# EAGLE design Grove - CO2 & Temperature & Humidity Sensor (SCD30) (EAGLE 9.1.2)

## Sheet 1 of 2
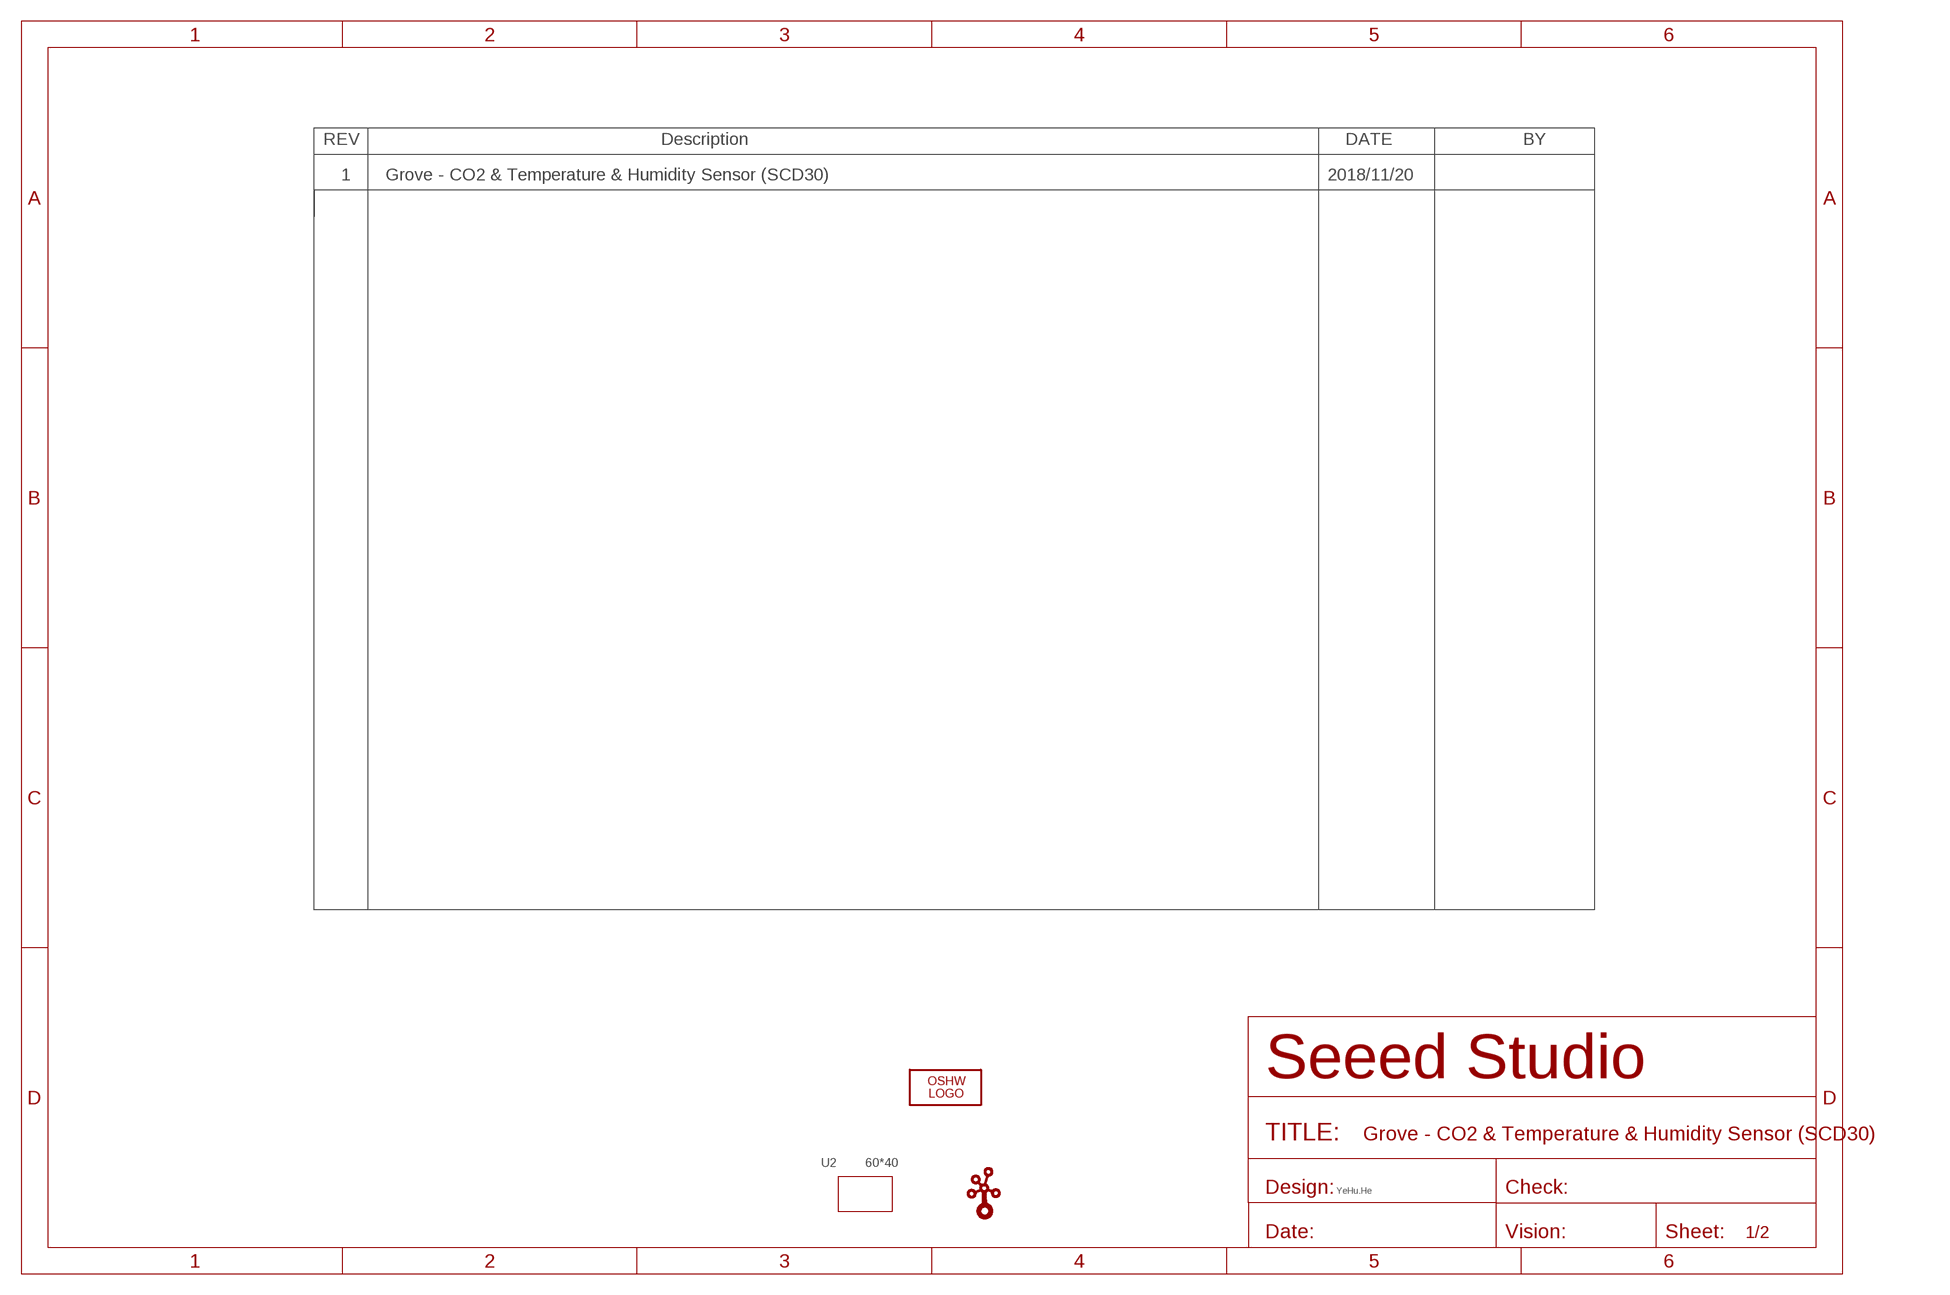
[diagram p0: schematic, sheet 1]

### Parts
LOGO1  LOGO-OSHW-FILLX0200-NT  [OSHW_FILLX200_NOTEXT]
U2  60*40  GROVE-60X40MM  [GROVE-60X40MM]
U$4  LOGO-GROVE  [GROVE-SILK-BIG]

### Notes on the sheet
- 1 | Grove - CO2 & Temperature & Humidity Sensor (SCD30) | 2018/11/20
- YeHu.He

## Sheet 2 of 2
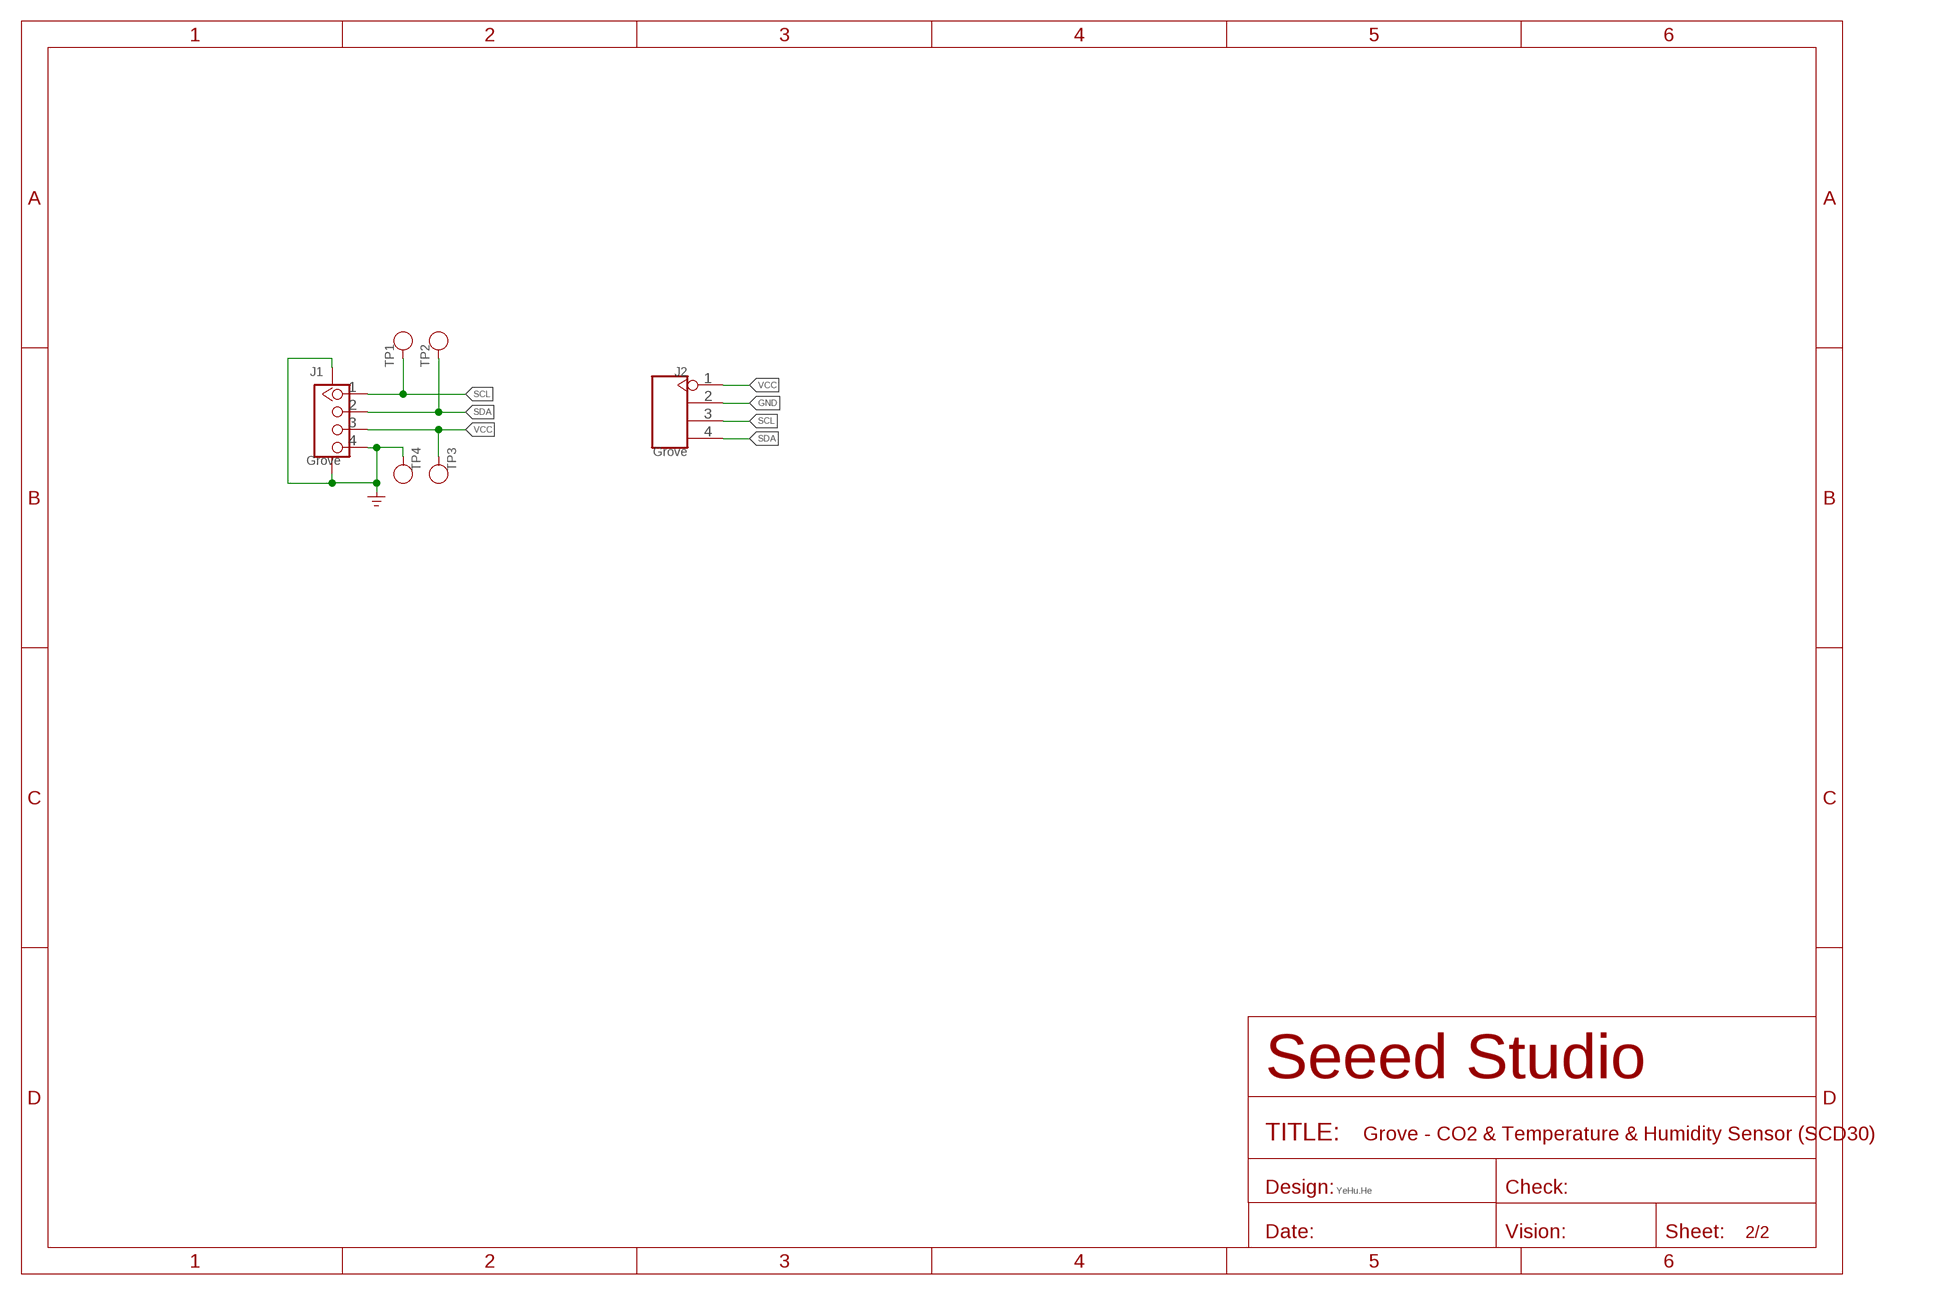
[diagram p1: schematic, sheet 2]

### Parts
J1  Grove  GROVE-CONNECTOR-SMD'90D'  [HW4-SMD-2.0-90D]
J2  Grove  HEADER-4P-65/35MIL  [H4-2.54]
TP1  Test  TEST-POINT'4545'  [TP-D45MIL]
TP2  Test  TEST-POINT'4545'  [TP-D45MIL]
TP3  Test  TEST-POINT'4545'  [TP-D45MIL]
TP4  Test  TEST-POINT'4545'  [TP-D45MIL]

### Nets
GND: J1.4 J1.SS1 J1.SS2 J2.2 TP4.T ; supply symbol labelled GND_POWER
SCL: J1.1 J2.3 TP1.T
SDA: J1.2 J2.4 TP2.T
VCC: J1.3 J2.1 TP3.T

### Notes on the sheet
- YeHu.He

## Library data of the parts
J1 = Connector-new:GROVE-CONNECTOR-SMD: 4P-SMD-2.0:320110030;4P-SMD-2.0-90D:320110032
J2 = Connector-new:HEADER-4P
LOGO1 = logo:LOGO-OSHW-FILL; PARTNO: DNP
TP1-TP4 = Discrete-new:TEST-POINT; PARTNO: DNP
U2 = moudle-new:GROVE
U$4 = logo:LOGO-GROVE; PARTNO: DNP

## Board
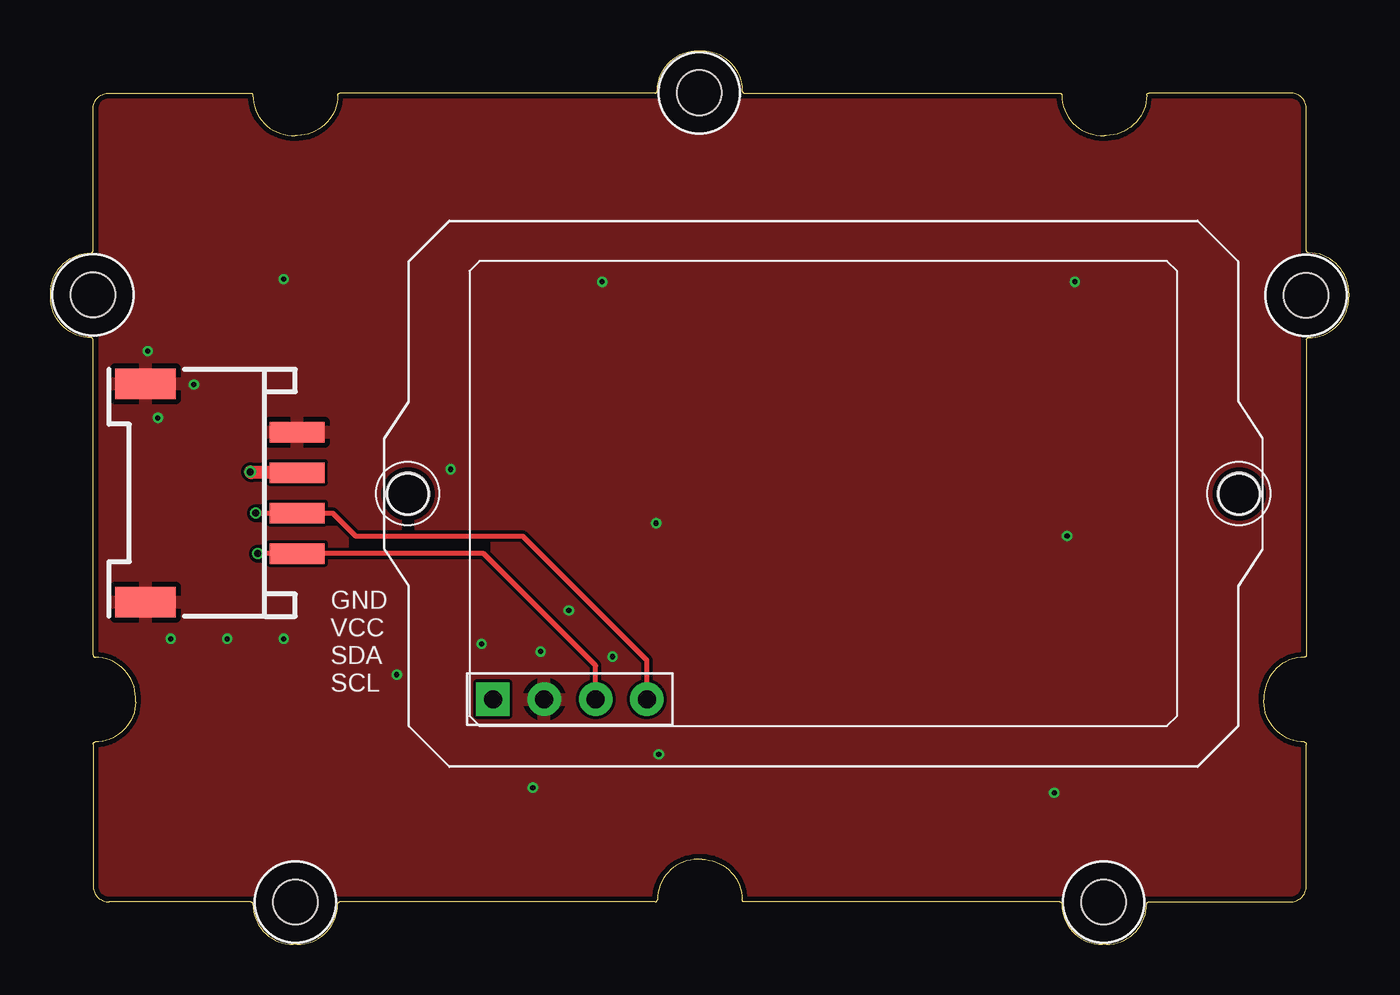
[diagram p2: board, top side]
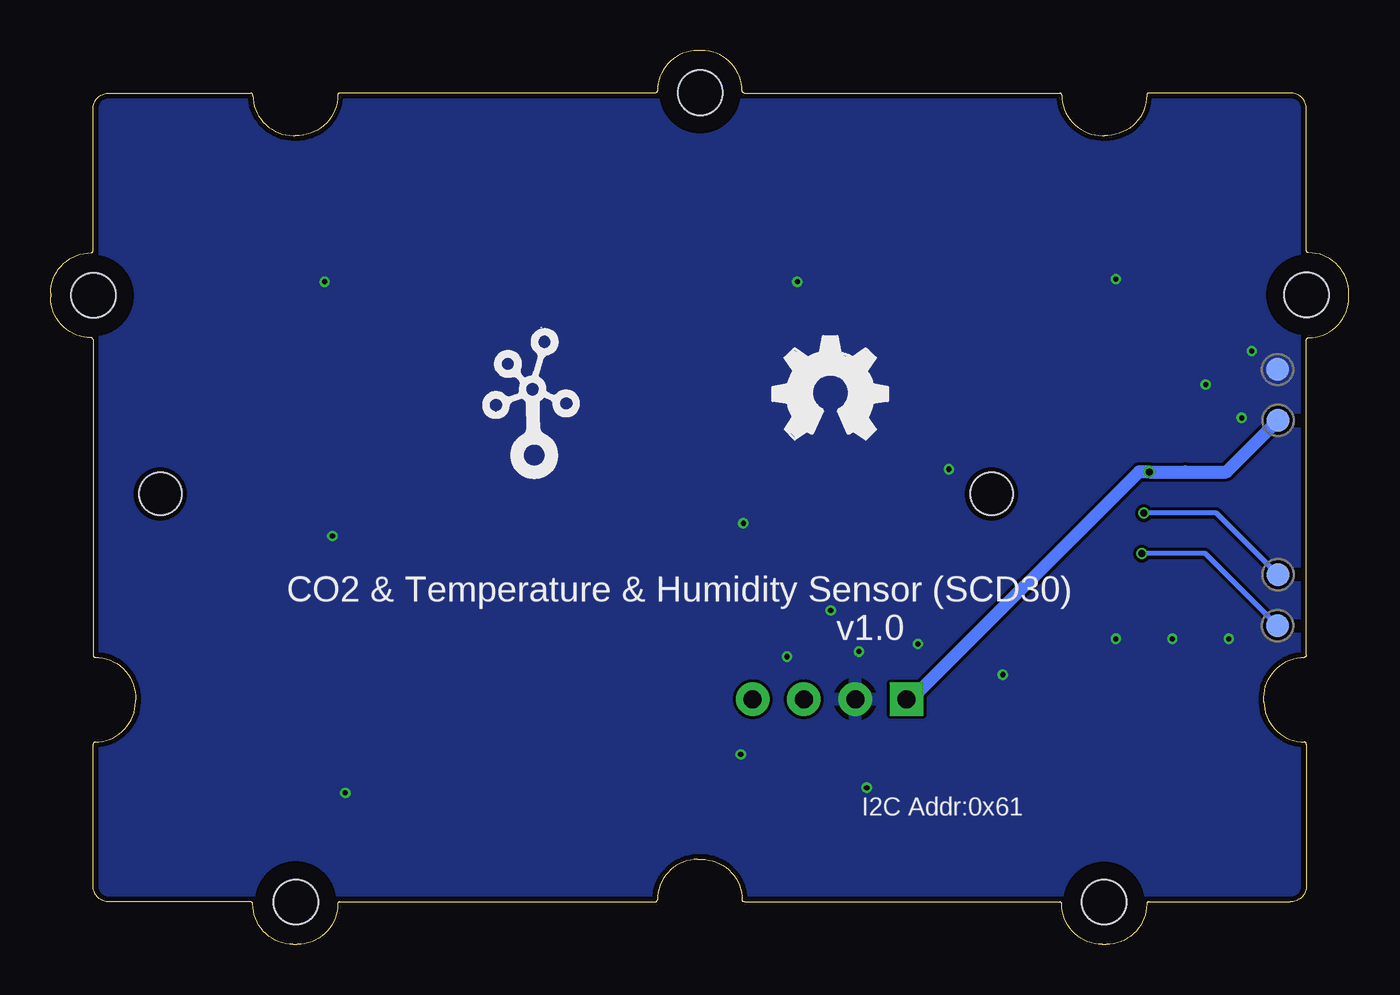
[diagram p3: board, bottom side, seen from below]

Size 64.2 x 44.2 mm. Coordinates in mm from the lower left corner, seen from the top.
Copper layers (1*16): Top 0.035mm / dielectric 1.5mm / Bottom 0.035mm
Design rules "SeeedStudio_2layer_DRU_no_angle_20140221": minimum track width 1mil, minimum drill 10mil, track to track 6mil, track to pad 6mil, pad to pad 6mil, via to via 6mil, smd to smd 0mil, copper to edge 10mil, drill to drill 10mil, minimum pad ring 4mil, minimum via ring 4mil, stop-mask expansion 2mil, vias tented up to drill 25mil, thermal gap 10mil
Holes 2.1 mm at 58.77,22.27 17.68,22.27

### Footprints (pad centres in the part's own frame; a part is rotated, then mirrored left to right if it is on the bottom)
HW4-SMD-2.0-90D = smd 1.01 x 2.74: 1 -3,-0.1; 2 -1,-0.1; 3 1,-0.1; 4 3,-0.1 | smd 1.5 x 3: SS1 -5.4,7.4; SS2 5.4,7.4
H4-2.54 = drill 0.889 pad 1.651 square: 1 0,3.81 | drill 0.889 pad 1.651: 2 0,1.27; 3 0,-1.27; 4 0,-3.81
TP-D45MIL = smd 1.143 x 1.143: T 0,0
GROVE-60X40MM = hole 2.2: -0.017,20.015; -30.005,10.02; 29.985,9.983; 19.98,-20.005; -19.983,-20.015; -30.005,10.02

### Placement (x,y rotation side)
J1  12.09,22.32 90 top
J2  25.68,12.12 90 top
LOGO1  28.48,24.99 0 bottom
TP1  3.53,15.75 180 bottom
TP2  3.51,18.28 180 bottom
TP3  3.51,25.91 180 bottom
TP4  3.54,28.42 180 bottom
U2  32.1,22.1 0 top
U$4  40.34,23.99 0 bottom

### Tracks (layer width: path | path; a pad name or v marks a point on that pad's centre or on a via)
GND  (via drill 0.25 pad 0.51)
  other vias: 23.85,7.75 30.07,9.4 27.78,14.22 24.23,14.48 21.31,14.86 25.63,16.51 19.78,23.49 17.12,13.33 11.53,15.11 8.73,15.11 5.94,15.11 5.31,26.03 7.08,27.68 4.8,29.34 11.53,32.89 27.28,32.76 29.94,20.83 49.63,7.49 50.26,20.19 50.64,32.76
  pour Top: 64.87,-1.78 -2.44,-1.78 -2.44,16.38 -2.44,45.21 64.87,45.21
  pour Bottom: -2.57,-1.78 -2.57,45.21 64.74,45.21 64.74,-1.78
SCL  (via drill 0.35 pad 0.51)
  Top 0.254: 12.04,19.32 J1.1 12.32,19.45 | 12.04,19.32 v10.24,19.32 | J2.3 26.95,13.79 21.41,19.32 12.04,19.32
  Bottom 0.254: TP1.T 7.1,19.32 v10.24,19.32
SDA  (via drill 0.35 pad 0.51)
  Top 0.254: v10.14,21.32 J1.2 | 12.16,21.59 12.16,21.35 J1.2 | J2.4 29.49,14.04 24.42,19.11 | 24.42,19.11 23.66,19.87 | J1.2 13.95,21.32 15.08,20.19 23.34,20.19 24.42,19.11
  Bottom 0.254: TP2.T 6.55,21.32 v10.14,21.32
VCC  (via drill 0.35)
  Top 0.635: 12.04,23.37 12.15,23.37 J1.3 | J1.3 9.92,23.32 v9.88,23.37 | J1.3 12.32,23.45
  Bottom 0.635: TP3.T 6.05,23.37 8.1,23.37 v9.88,23.37 10.39,23.37 21.58,12.18 21.82,12.18 J2.1

### Text on the board
tNames: GND | VCC | SDA | SCL
bNames: CO2 & Temperature & Humidity Sensor (SCD30) / v1.0 | I2C Addr:0x61